# EAGLE schematic Baja Breakout (EAGLE 9.6.2)
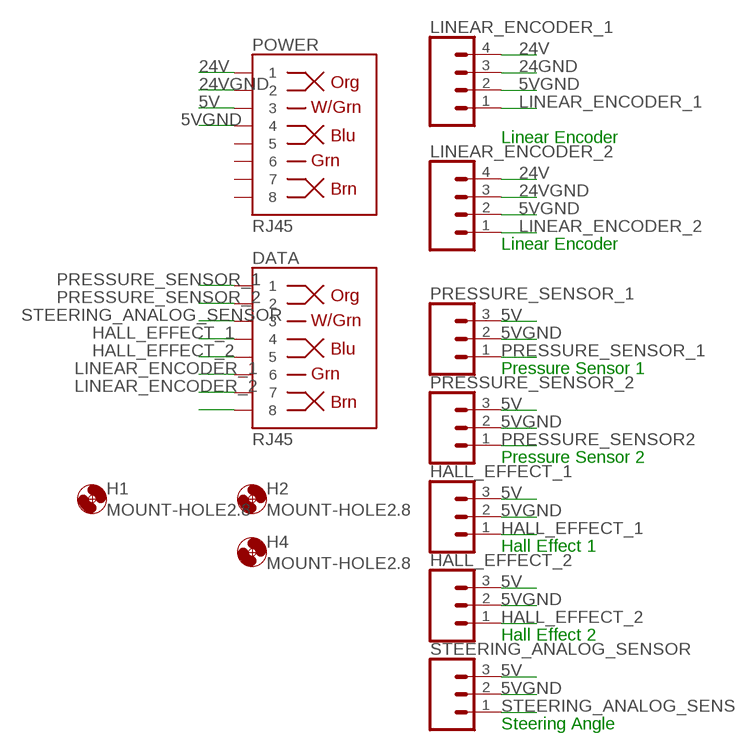
[diagram p0: schematic, sheet 1]

## Parts
DATA  RJ45  RJ45-8  [RJ45-8]
H1  MOUNT-HOLE2.8  [2,8]
H2  MOUNT-HOLE2.8  [2,8]
H4  MOUNT-HOLE2.8  [2,8]
HALL_EFFECT_1  CONN_03  [1X03]
HALL_EFFECT_2  CONN_03  [1X03]
LINEAR_ENCODER_1  CONN_04  [1X04]
LINEAR_ENCODER_2  CONN_04  [1X04]
POWER  RJ45  RJ45-8  [RJ45-8]
PRESSURE_SENSOR_1  CONN_03  [1X03]
PRESSURE_SENSOR_2  CONN_03  [1X03]
STEERING_ANALOG_SENSOR  CONN_03  [1X03]

## Nets
5V: HALL_EFFECT_1.3 HALL_EFFECT_2.3 POWER.3 PRESSURE_SENSOR_1.3 PRESSURE_SENSOR_2.3 STEERING_ANALOG_SENSOR.3
5VGND: HALL_EFFECT_1.2 HALL_EFFECT_2.2 LINEAR_ENCODER_1.2 LINEAR_ENCODER_2.2 POWER.4 PRESSURE_SENSOR_1.2 PRESSURE_SENSOR_2.2 STEERING_ANALOG_SENSOR.2
24GND: LINEAR_ENCODER_1.3
24V: LINEAR_ENCODER_1.4 LINEAR_ENCODER_2.4 POWER.1
24VGND: LINEAR_ENCODER_2.3 POWER.2
HALL_EFFECT_1: DATA.4 HALL_EFFECT_1.1
HALL_EFFECT_2: DATA.5 HALL_EFFECT_2.1
LINEAR_ENCODER_1: DATA.6 LINEAR_ENCODER_1.1
LINEAR_ENCODER_2: DATA.7 LINEAR_ENCODER_2.1
N$8: DATA.8
PRESSURE_SENSOR2: PRESSURE_SENSOR_2.1
PRESSURE_SENSOR_1: DATA.1 PRESSURE_SENSOR_1.1
PRESSURE_SENSOR_2: DATA.2
STEERING_ANALOG_SENSOR: DATA.3 STEERING_ANALOG_SENSOR.1
Unconnected: POWER.5 POWER.6 POWER.7 POWER.8

## Notes on the sheet
- Linear Encoder
- Linear Encoder
- Pressure Sensor 1
- Pressure Sensor 2
- Hall Effect 1
- Hall Effect 2
- Steering Angle

## Library data of the parts
DATA POWER = SparkFun-Connectors:RJ45-8: RJ45 Jack - 8 pin Simple RJ45, 8-pin connection. Commonly used for Cat5, Cat5e, and Cat6 Ethernet cables. Here is the connector we sell at SparkFun: RJ45 8-Pin Connector <https://www.sparkfun.com/products/643> (PRT-00643) Datasheet <https://cdn.sparkfun.com/datasheets/Prototyping/04908.pdf> It is used on this SparkFun product: SparkFun RJ45 Breakout <https://www.sparkfun.com/products/716> (BOB-00716) Note, you may also be interested in the "MAGJACK" version of this. It is basically a RJ45 connector, but also has some status LEDs built into the connector housing. You can check that out in this library at the device named "MAGJACK.dev" and see these products online: RJ45 Ethernet MagJack-Compatible <https://www.sparkfun.com/products/8534> (PRT-08534) SparkFun RJ45 MagJack Breakout <https://www.sparkfun.com/products/13021> (BOB-13021); PROD_ID: CONN-08506; SF_ID: PRT-00643
H1 H2 H4 = holes:MOUNT-HOLE: MOUNTING HOLE with drill center marker
HALL_EFFECT_1 HALL_EFFECT_2 PRESSURE_SENSOR_1 PRESSURE_SENSOR_2 STEERING_ANALOG_SENSOR = 3 pin through:CONN_03: Multi connection point. Often used as Generic Header-pin footprint for 0.1 inch spaced/style header connections On any of the 0.1 inch spaced packages, you can populate with these: Break Away Headers - Straight <https://www.sparkfun.com/products/116> (PRT-00116) Break Away Male Headers - Right Angle <https://www.sparkfun.com/products/553> (PRT-00553) Female Headers <https://www.sparkfun.com/products/115> (PRT-00115) Break Away Headers - Machine Pin <https://www.sparkfun.com/products/117> (PRT-00117) Break Away Female Headers - Swiss Machine Pin <https://www.sparkfun.com/products/743> (PRT-00743) Stackable Header - 3 Pin (Female, 0.1") <https://www.sparkfun.com/products/13875> (PRT-13875) For SCREWTERMINALS and SPRING TERMINALS visit here: Screw Terimnals on SparkFun.com <https://www.sparkfun.com/search/results?term=Screw+Terminals> (5mm/3.5mm/2.54mm spacing) This device is also useful as a general connection point to wire up your design to another part of your project. Our various solder wires solder well into these plated through hole pads. Hook-Up Wire - Assortment (Stranded, 22 AWG) <https://www.sparkfun.com/products/11375> (PRT-11375) Hook-Up Wire - Assortment (Solid Core, 22 AWG) <https://www.sparkfun.com/products/11367> (PRT-11367) View the entire wire category on our website here <https://www.sparkfun.com/categories/141> Special notes: Molex polarized connector foot print use with SKU : PRT-08232 with associated crimp pins and housings.
LINEAR_ENCODER_1 LINEAR_ENCODER_2 = 4 pin through:CONN_04: Multi connection point. Often used as Generic Header-pin footprint for 0.1 inch spaced/style header connections On any of the 0.1 inch spaced packages, you can populate with these: Break Away Headers - Straight <https://www.sparkfun.com/products/116> (PRT-00116) Break Away Male Headers - Right Angle <https://www.sparkfun.com/products/553> (PRT-00553) Female Headers <https://www.sparkfun.com/products/115> (PRT-00115) Break Away Headers - Machine Pin <https://www.sparkfun.com/products/117> (PRT-00117) Break Away Female Headers - Swiss Machine Pin <https://www.sparkfun.com/products/743> (PRT-00743) For SCREWTERMINALS and SPRING TERMINALS visit here: Screw Terimnals on SparkFun.com <https://www.sparkfun.com/search/results?term=Screw+Terminals> (5mm/3.5mm/2.54mm spacing) This device is also useful as a general connection point to wire up your design to another part of your project. Our various solder wires solder well into these plated through hole pads. Hook-Up Wire - Assortment (Stranded, 22 AWG) <https://www.sparkfun.com/products/11375> (PRT-11375) Hook-Up Wire - Assortment (Solid Core, 22 AWG) <https://www.sparkfun.com/products/11367> (PRT-11367) View the entire wire category on our website here <https://www.sparkfun.com/categories/141> Special notes: Molex polarized connector foot print use with SKU : PRT-08231 with associated crimp pins and housings. 1MM SMD Version SKU: PRT-10208; PROD_ID: CONN-09696